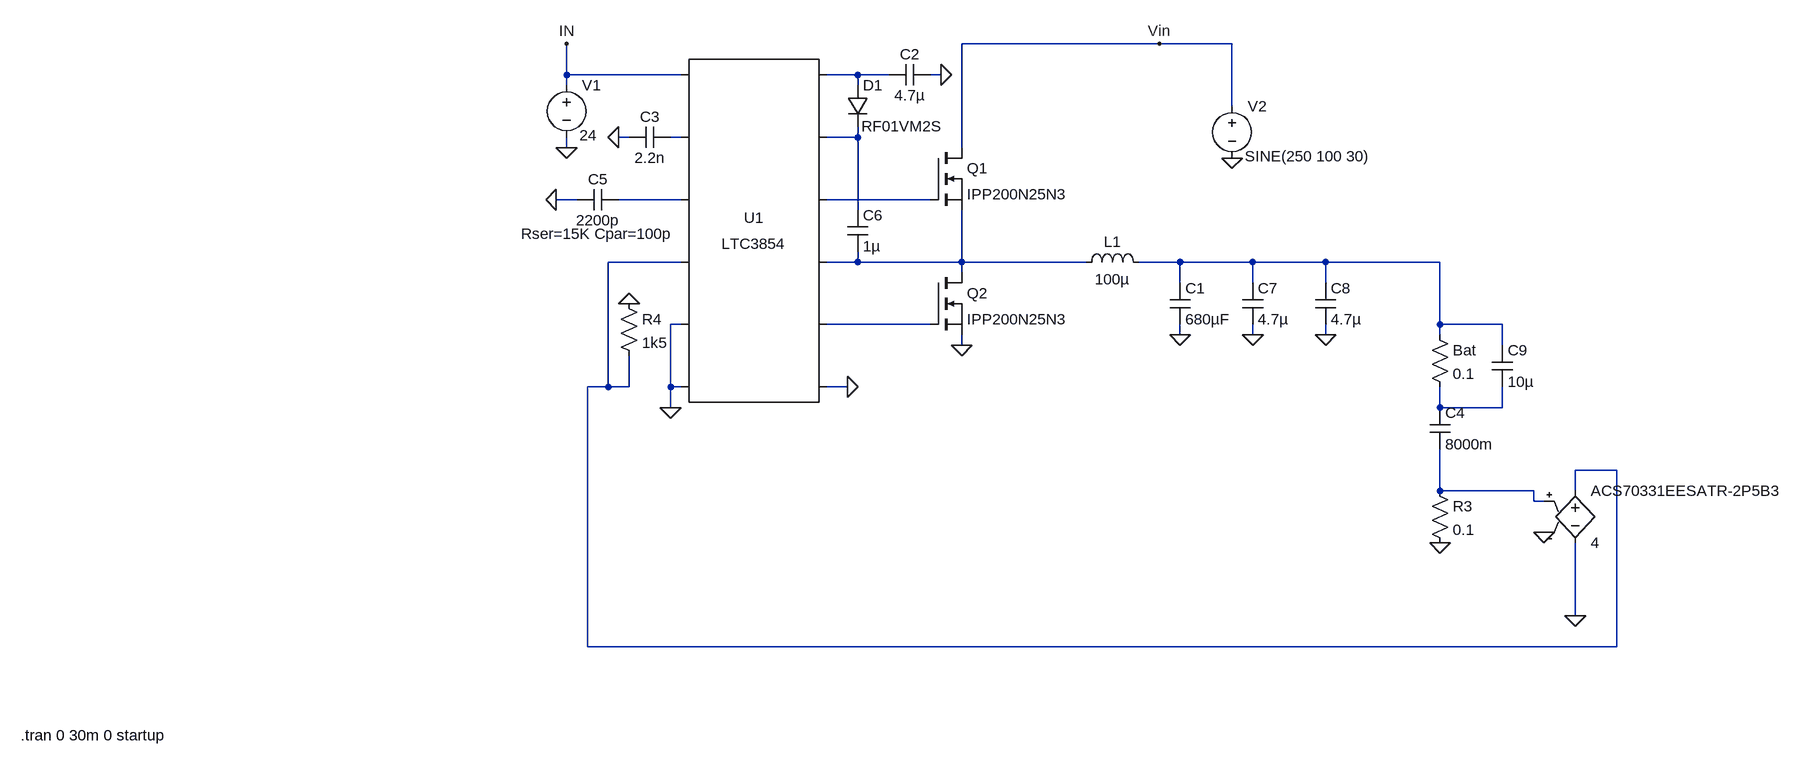
[diagram p0: schematic LTspice simulation.asc]
LTspice simulation.asc, the LTspice schematic file:
Version 4
SHEET 1 2364 1016
WIRE 800 -64 496 -64
WIRE 912 -64 800 -64
WIRE -112 -16 -112 -64
WIRE 64 -16 -112 -16
WIRE 336 -16 288 -16
WIRE 384 -16 336 -16
WIRE 464 -16 448 -16
WIRE -112 0 -112 -16
WIRE 336 0 336 -16
WIRE 912 32 912 -64
WIRE -16 80 -32 80
WIRE 64 80 48 80
WIRE 336 80 336 64
WIRE 336 80 288 80
WIRE -112 96 -112 80
WIRE 496 96 496 -64
WIRE -96 176 -128 176
WIRE 64 176 -32 176
WIRE 448 176 288 176
WIRE 336 192 336 80
WIRE 64 272 -48 272
WIRE 336 272 336 256
WIRE 336 272 288 272
WIRE 496 272 496 192
WIRE 496 272 336 272
WIRE 688 272 496 272
WIRE 832 272 768 272
WIRE 944 272 832 272
WIRE 1056 272 944 272
WIRE 1232 272 1056 272
WIRE 496 288 496 272
WIRE 832 304 832 272
WIRE 944 304 944 272
WIRE 1056 304 1056 272
WIRE 64 368 48 368
WIRE 448 368 288 368
WIRE 1232 368 1232 272
WIRE 1328 368 1232 368
WIRE 832 384 832 368
WIRE 944 384 944 368
WIRE 1056 384 1056 368
WIRE 1232 384 1232 368
WIRE 496 400 496 384
WIRE 1328 400 1328 368
WIRE -48 464 -48 272
WIRE -48 464 -80 464
WIRE -16 464 -16 416
WIRE -16 464 -48 464
WIRE 48 464 48 368
WIRE 64 464 48 464
WIRE 320 464 288 464
WIRE 48 496 48 464
WIRE 1232 496 1232 464
WIRE 1328 496 1328 464
WIRE 1328 496 1232 496
WIRE 1504 592 1440 592
WIRE 1232 624 1232 560
WIRE 1376 624 1232 624
WIRE 1440 624 1440 592
WIRE 1376 640 1376 624
WIRE 1392 640 1376 640
WIRE 1440 816 1440 704
WIRE -80 864 -80 464
WIRE 1504 864 1504 592
WIRE 1504 864 -80 864
FLAG 320 464 0
FLAG 496 400 0
FLAG 832 384 0
FLAG 464 -16 0
FLAG -32 80 0
FLAG -112 96 0
FLAG -112 -64 IN
FLAG -128 176 0
FLAG 912 112 0
FLAG 48 496 0
FLAG 1232 704 0
FLAG 1392 688 0
FLAG -16 336 0
FLAG 1440 816 0
FLAG 1056 384 0
FLAG 944 384 0
FLAG 800 -64 Vin
SYMBOL nmos 448 96 R0
SYMATTR InstName Q1
SYMATTR Value IPP200N25N3
SYMBOL ind 672 288 R270
WINDOW 0 32 56 VTop 2
WINDOW 3 5 56 VBottom 2
SYMATTR InstName L1
SYMATTR Value 100µ
SYMATTR SpiceLine Rser=140m
SYMBOL cap 816 304 R0
SYMATTR SpiceLine Rser=4.5m
SYMATTR InstName C1
SYMATTR Value 680µF
SYMBOL cap 384 0 R270
WINDOW 0 32 32 VTop 2
WINDOW 3 0 32 VBottom 2
SYMATTR InstName C2
SYMATTR Value 4.7µ
SYMBOL cap 48 64 R90
WINDOW 0 0 32 VBottom 2
WINDOW 3 32 32 VTop 2
SYMATTR InstName C3
SYMATTR Value 2.2n
SYMBOL voltage -112 -16 R0
WINDOW 3 20 93 Left 2
WINDOW 123 0 0 Left 2
WINDOW 39 0 0 Left 2
SYMATTR Value 24
SYMATTR InstName V1
SYMBOL diode 320 0 R0
WINDOW 3 22 63 Left 2
SYMATTR Value RF01VM2S
SYMATTR InstName D1
SYMBOL nmos 448 288 R0
SYMATTR InstName Q2
SYMATTR Value IPP200N25N3
SYMBOL cap -32 160 R90
WINDOW 0 0 32 VBottom 2
WINDOW 3 32 32 VTop 2
WINDOW 39 53 32 VTop 2
SYMATTR InstName C5
SYMATTR Value 2200p
SYMATTR SpiceLine Rser=15K Cpar=100p
SYMBOL PowerProducts\\LTC3854 176 224 R0
SYMATTR InstName U1
SYMBOL cap 320 192 R0
SYMATTR InstName C6
SYMATTR Value 1µ
SYMBOL voltage 912 16 R0
WINDOW 3 20 93 Left 2
WINDOW 123 0 0 Left 2
WINDOW 39 0 0 Left 2
SYMATTR Value SINE(250 100 30)
SYMATTR InstName V2
SYMBOL e 1440 608 R0
SYMATTR InstName ACS70331EESATR-2P5B3
SYMATTR Value 4
SYMBOL res 1216 608 R0
SYMATTR InstName R3
SYMATTR Value 0.1
SYMBOL res 1216 368 R0
SYMATTR InstName Bat
SYMATTR Value 0.1
SYMBOL res -32 320 R0
SYMATTR InstName R4
SYMATTR Value 1k5
SYMBOL cap 1216 496 R0
SYMATTR InstName C4
SYMATTR Value 8000m
SYMATTR Value2 IC=24
SYMBOL cap 928 304 R0
SYMATTR InstName C7
SYMATTR Value 4.7µ
SYMBOL cap 1040 304 R0
SYMATTR InstName C8
SYMATTR Value 4.7µ
SYMBOL cap 1312 400 R0
SYMATTR InstName C9
SYMATTR Value 10µ
TEXT -952 1000 Left 2 !.tran 0 30m 0 startup

The netlist it stands for:
* LTspice simulation.asc
M§Q1 Vin N005 N007 N007 IPP200N25N3
L1 N007 N008 100µ Rser=140m
C1 N008 0 680µF Rser=4.5m
C2 N001 0 4.7µ
C3 N002 0 2.2n
V1 IN 0 24
D1 N001 N003 RF01VM2S
M§Q2 N007 N009 0 0 IPP200N25N3
C5 N004 0 2200p Rser=15K Cpar=100p
XU1 N006 N004 N002 N003 N005 N007 0 N009 N001 IN 0 0 LTC3854
C6 N003 N007 1µ
V2 Vin 0 SINE(250 100 30)
E§ACS70331EESATR-2P5B3 N006 0 N011 0 4
R3 N011 0 0.1
R§Bat N008 N010 0.1
R4 0 N006 1k5
C4 N010 N011 8000m IC=24
C7 N008 0 4.7µ
C8 N008 0 4.7µ
C9 N008 N010 10µ
.model D D
.lib standard.dio
.model NMOS NMOS
.model PMOS PMOS
.lib standard.mos
.tran 0 30m 0 startup
.lib LTC3854.sub
.backanno
.end